# EAGLE design led_brick_smd (EAGLE 7.2.0)
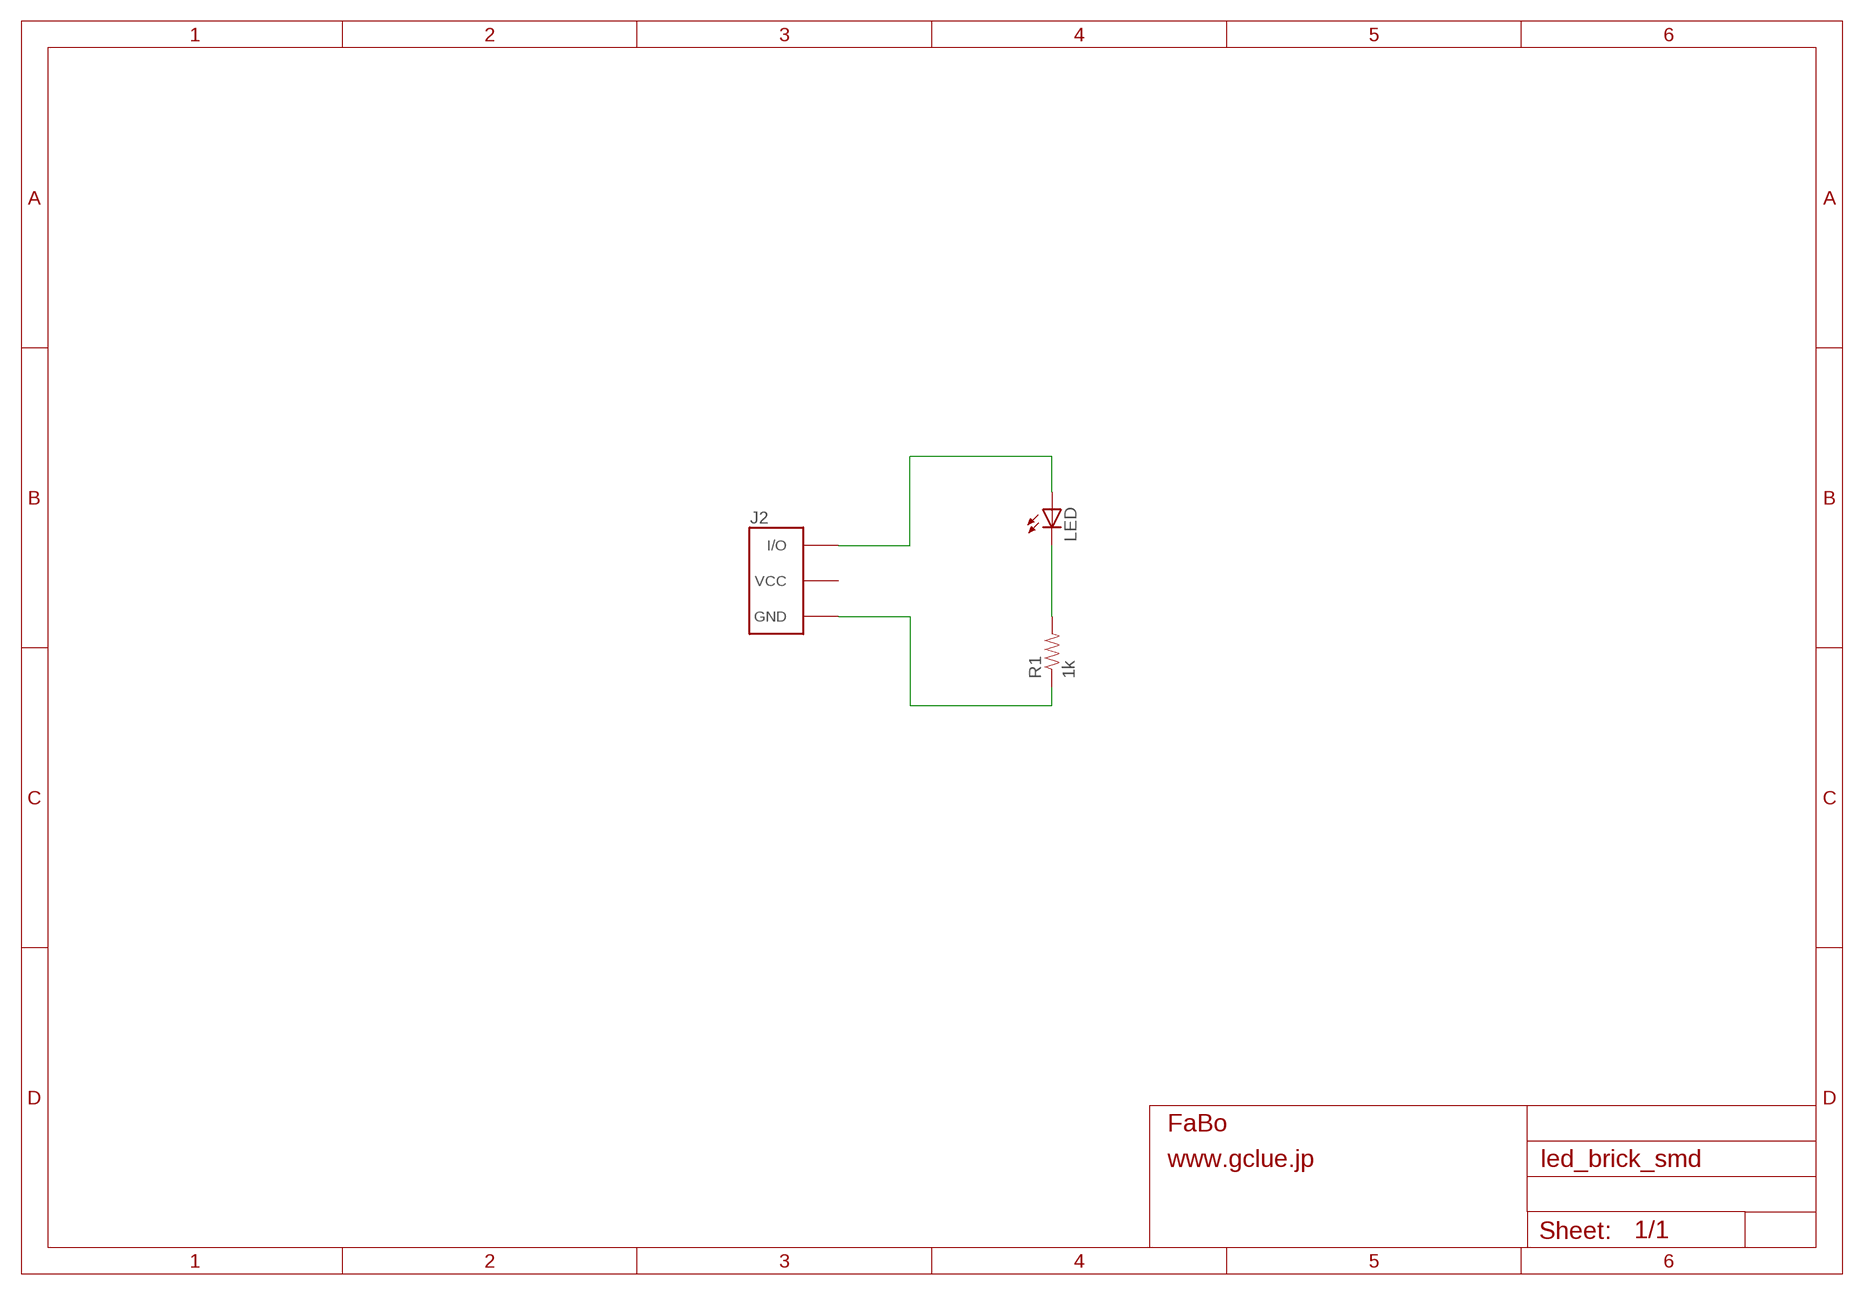
[diagram p0: schematic, sheet 1]

## Parts
J2  BRICK_3PIN  [BRICK_3PIN]
LED  LED  LEDCHIP-LED0603  [CHIP-LED0603]
R1  1k  RESISTOR0603-RES  [0603-RES]

## Nets
GND: J2.GND R1.1
N$1: J2.IN/OUT(I/O) LED.A
N$3: LED.C R1.2
Unconnected: J2.VCC

## Library data of the parts
J2 = Gclue:BRICK_3PIN: FaBo Brick 3pin
LED = adafruit:LED: LED OSRAM: - CHIPLED LG R971, LG N971, LY N971, LG Q971, LY Q971, LO R971, LY R971 LH N974, LH R974 LS Q976, LO Q976, LY Q976 LO Q996 - Hyper CHIPLED LW Q18S LB Q993, LB Q99A, LB R99A - SideLED LS A670, LO A670, LY A670, LG A670, LP A670 LB A673, LV A673, LT A673, LW A673 LH A674 LY A675 LS A676, LA A676, LO A676, LY A676, LW A676 LS A679, LY A679, LG A679 - Hyper Micro SIDELED® LS Y876, LA Y876, LO Y876, LY Y876 LT Y87S - SmartLED LW L88C, LW L88S LB L89C, LB L89S, LG L890 LS L89K, LO L89K, LY L89K LS L896, LA L896, LO L896, LY L896 - TOPLED LS T670, LO T670, LY T670, LG T670, LP T670 LSG T670, LSP T670, LSY T670, LOP T670, LYG T670 LG T671, LOG T671, LSG T671 LB T673, LV T673, LT T673, LW T673 LH T674 LS T676, LA T676, LO T676, LY T676, LB T676, LH T676, LSB T676, LW T676 LB T67C, LV T67C, LT T67C, LS T67K, LO T67K, LY T67K, LW E67C LS E67B, LA E67B, LO E67B, LY E67B, LB E67C, LV E67C, LT E67C LW T67C LS T679, LY T679, LG T679 LS T770, LO T770, LY T770, LG T770, LP T770 LB T773, LV T773, LT T773, LW T773 LH T774 LS E675, LA E675, LY E675, LS T675 LS T776, LA T776, LO T776, LY T776, LB T776 LHGB T686 LT T68C, LB T68C - Hyper Mini TOPLED® LB M676 - Mini TOPLED Santana® LG M470 LS M47K, LO M47K, LY M47K Source: http://www.osram.convergy.de/
R1 = SparkFun:RESISTOR: Resistor Basic schematic elements and footprints for 0603, 1206, and PTH resistors.

## Board
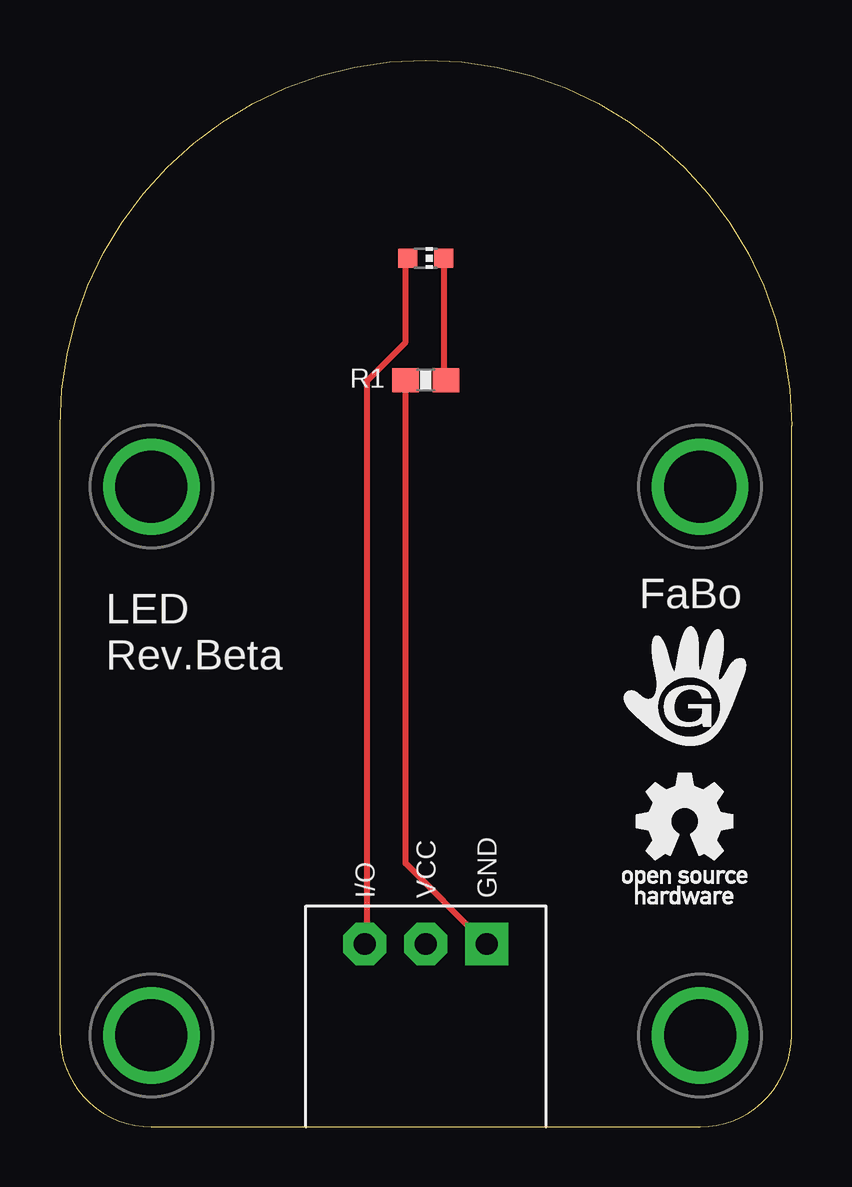
[diagram p1: board, top side]
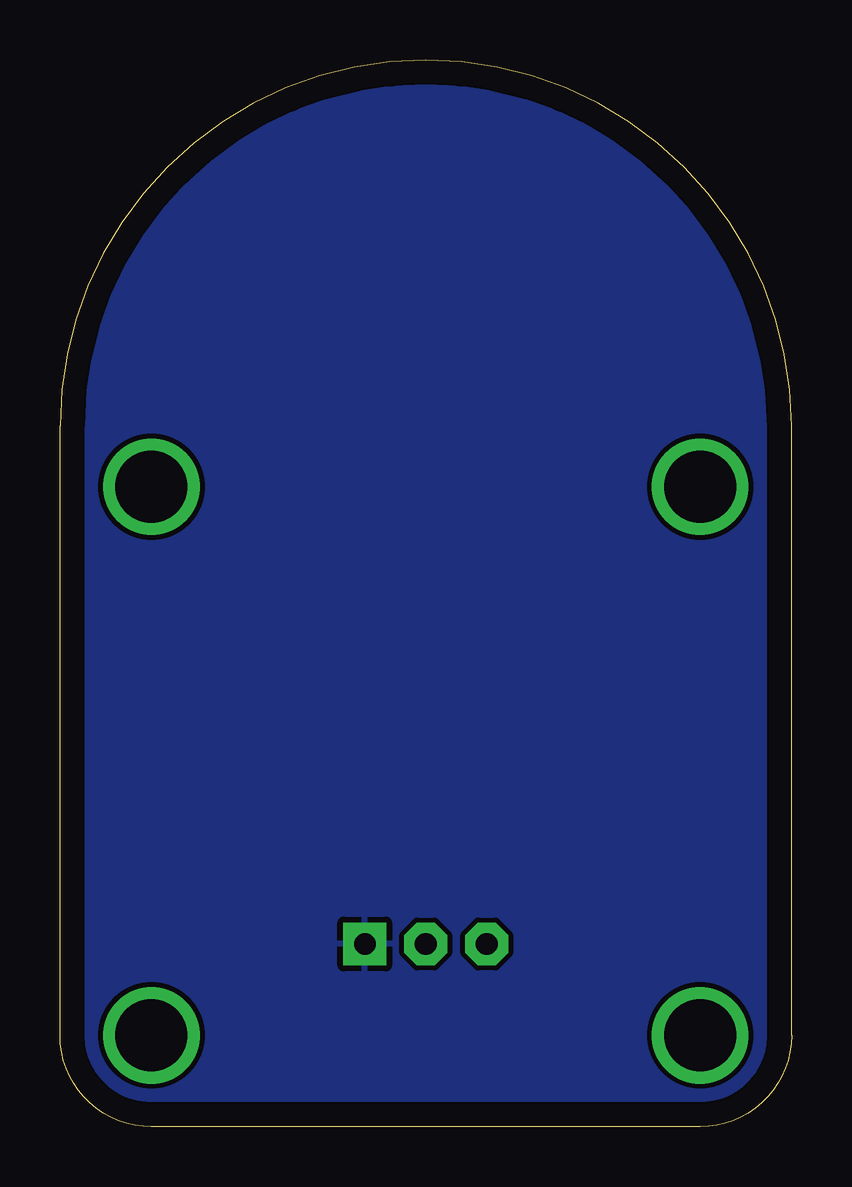
[diagram p2: board, bottom side, seen from below]

Size 30.48 x 44.45 mm. Coordinates in mm from the lower left corner, seen from the top.
Copper layers (1*16): Top 0.035mm / dielectric 1.5mm / Bottom 0.035mm
Design rules "default": minimum track width 10mil, minimum drill 24mil, track to track 8mil, track to pad 8mil, pad to pad 8mil, via to via 8mil, smd to smd 8mil, copper to edge 40mil, drill to drill 8mil, minimum pad ring 10mil, minimum via ring 8mil, stop-mask expansion 4mil, vias tented up to drill 0mil, thermal gap 10mil

### Footprints (pad centres in the part's own frame; a part is rotated, then mirrored left to right if it is on the bottom)
BRICK_3PIN = drill 0.9 pad 1.778 square: GND 2.54,-11.43 | drill 0.9 pad 1.778 octagon: IN/OUT -2.54,-11.43; VCC 0,-11.43 | drill 3 pad 3.81: P$1 -11.43,7.62; P$2 11.43,7.62; P$3 11.43,-15.24; P$4 -11.43,-15.24
CHIP-LED0603 = smd 0.8 x 0.8: A 0,-0.75; C 0,0.75
0603-RES = smd 1.1 x 1: 1 -0.85,0; 2 0.85,0

### Placement (x,y rotation side)
J2  15.24,19.05 0 top
LED  15.24,36.2 270 top
R1  15.24,31.11 0 top
U$2  [LOGO_GCLUE_M]  26.04,18.41 0 top
U$3  [LOGO_OSHW_T_M]  26.04,12.7 0 top

### Tracks (layer width: path | path; a pad name or v marks a point on that pad's centre or on a via)
GND
  Top 0.254: R1.1 14.4,31.09 14.4,10.97 17.6,7.77 J2.GND
  pour Bottom: 0,0 30.48,0 31.11,45.09 0,45.09
N$1
  Top 0.254: LED.A 14.4,36.12 14.4,32.69 12.8,31.09 12.8,7.77 J2.IN/OUT
N$3
  Top 0.254: LED.C 16,36.12 16,31.32 R1.2

### Text on the board
tPlace: FaBo | LED / Rev.Beta